# Altium schematic sheet 1_Power_Path.SchDoc: Power_Path
size A4; ApprovedBy: Alcatraz; CheckedBy: Alcatraz; Author: Alcatraz; CompanyName: DHNLAB; DrawnBy: Alcatraz; Engineer: Alcatraz; Organization: DHNLAB PVT LTD; Address1: DHANBAD; Address2: JHARKHAND; Address3: INDIA; Address4: ASIA; DocumentNumber: 1; Revision: 1.0; SheetNumber: 1; SheetTotal: 7; ProjectTitle: USB-UART-ISO-CP2102
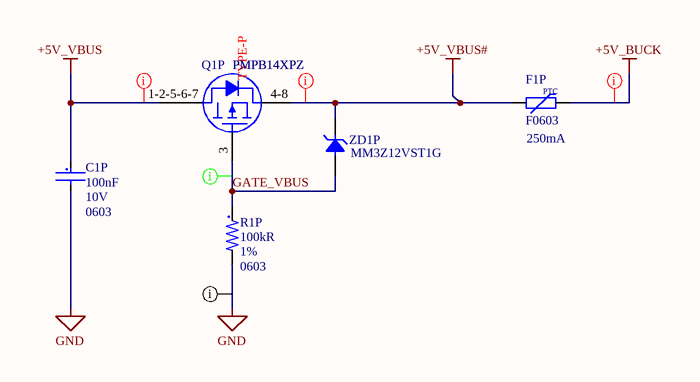
[diagram p0: 1_Power_Path.SchDoc]

## Parts
C1P  value 100nF  Voltage: 10V  Case/Package: 0603  [C0603-IPC_C_No_Silk]  (hidden comment: C0603C104K8RACTU)
F1P  F0603  value 250mA  [R0603-MFG]
Q1P  PMPB14XPZ  [DFN2020MD-MFG]
R1P  value 100kR  Tolerance: 1%  Case/Package: 0603  [R0603-MFG]  (hidden comment: AC0603FR-07100KL)
ZD1P  MM3Z12VST1G  [SOD-323]

## Nets
+5V_BUCK: F1P.2
+5V_VBUS: C1P.1 Q1P.1-2-5-6-7(D)
+5V_VBUS#: F1P.1 Q1P.4-8(S) ZD1P.1(C)
GND: C1P.2 R1P.2
GATE_VBUS: Q1P.3(G) R1P.1 ZD1P.2(A)

## Layout directives
net class Power; net class PowerRails_LowVoltage_DC: +5V_BUCK, +5V_VBUS, +5V_VBUS#
net class GND; net class PowerRails_GND: GND
net class Digital_Signal_Low_Speed; net class Signal: GATE_VBUS

## Notes on the sheet
- Title:
- Author:
- Approved:
- Size:
- Date:
- Git Hash:
- A4
- Prj:
- SW Version:
- Variant:
- Edited:
- PUBLIC
- File:
- (in symbol FUSE_PPTC_0603) PTC
- (in symbol PMPB14XPZ) TYPE-P

## Library data of the parts
C1P = 100nF_10V: Multilayer Ceramic Capacitor, 0.1 uF, 10 V, ± 10%, X7R, 0603 [1608 Metric]; Manufacturer: KEMET; Material: 4241ConductorMaterial; Dissipation Factor: 5%; Temperature Coefficient: 30ppm/°C; Manufacturer Part Number: C0603C104K8RACTU; Supplier 1: Mouser; Category: Ceramic Capacitors; Stock 1: 246409; Pricing 1: 1=0.11, 10=0.075, 50=0.075, 100=0.036, 1000=0.021, 10000=0.017 (USD); Supplier Part Number 1: 80-C0603C104K8R; RoHS: Yes; Mounting Technology: Surface Mount,PCB; Pins: 2; Case Code (Imperial): 0603; Case Code (Metric): 1608; Dielectric Material: Ceramic; Min Operating Temperature: -55°C; Max Operating Temperature: 125°C; Tolerance: 10%; Voltage Rating: 10V; Packaging: Tape and Reel; Dielectric: X7R; Series: C; Package Quantity: 1; Termination: SMD/SMT; Construction: Flat; Length: 1.6mm; Width: 0.031inch; Height: 0.8mm; Thickness: 0.034inch; Lead Pitch: 0.7mm; Depth: 0.8mm; Radiation Hardening: No; Reach SVHC Compliant: No; RoHS Compliant: Yes; Lead Free: 5697LeadFree; ComponentLink1URL: https://datasheet.ciiva.com/6093/1776114-6093269.pdf?src-supplier=Farnell; ComponentLink1Description: https://datasheet.ciiva.com/6093/1776114-6093269.pdf?src-supplier=Farnell; ComponentLink2URL: https://datasheet.ciiva.com/7823/kem-c1002-x7r-smd-7823989.pdf?src-supplier=Element14; ComponentLink2Description: https://datasheet.ciiva.com/7823/kem-c1002-x7r-smd-7823989.pdf?src-supplier=Element14; ComponentLink3URL: https://datasheet.ciiva.com/22693/1851736-22693967.pdf?src-supplier=Element14; ComponentLink3Description: https://datasheet.ciiva.com/22693/1851736-22693967.pdf?src-supplier=Element14; ComponentLink4URL: https://datasheet.ciiva.com/14589/70095383-14589402.pdf?src-supplier=Allied+Electronics; ComponentLink4Description: https://datasheet.ciiva.com/14589/70095383-14589402.pdf?src-supplier=Allied+Electronics; ComponentLink5URL: https://datasheet.ciiva.com/14593/70095383-14593978.pdf?src-supplier=Allied+Electronics; ComponentLink5Description: https://datasheet.ciiva.com/14593/70095383-14593978.pdf?src-supplier=Allied+Electronics; ComponentLink6URL: https://datasheet.ciiva.com/5419/kem-c1002-x7r-smd-357932-5419657.pdf?src-supplier=Mouser; ComponentLink6Description: https://datasheet.ciiva.com/5419/kem-c1002-x7r-smd-357932-5419657.pdf?src-supplier=Mouser; ComponentLink7URL: https://datasheet.ciiva.com/18192/getdatasheetpartid-91529-18192711.pdf?src-supplier=Verical; ComponentLink7Description: https://datasheet.ciiva.com/18192/getdatasheetpartid-91529-18192711.pdf?src-supplier=Verical; Voltage Rating (DC): 10V
F1P = FUSE_PPTC_0603: Fuse PPTC SMD 0603; Manufacturer: *; Manufacturer Part Number: *
Q1P = PMPB14XPZ: Manufacturer: Nexperia; Supplier 1: Element14; Supplier Part Number 1: 4177131; Manufacturer Part Number: PMPB14XPZ; RoHS: No; Stock 1: 3000
R1P = 100K: SMD Chip Resistor, 100 kOhm, ± 1%, 100 mW, 0603 [1608 Metric], Thick Film, General Purpose; Manufacturer: Yageo; Power Rating: 100mW; Temperature Coefficient: 100ppm/°C; Voltage Rating: 50V; Working Voltage: 75V; Supplier 1: Future Electronics; Manufacturer Part Number: AC0603FR-07100KL; RoHS: Yes; Category: Chip SMD Resistors; Stock 1: 3790000; Pricing 1: 5000=0.0034, 25000=0.0018, 75000=0.0032, 125000=0.0017, 250000=0.0031, 750000=0.003, 2500000=0.0027 (USD); Case Code (Imperial): 0603; Case Code (Metric): 1608; Min Operating Temperature: -55°C; Max Operating Temperature: 155°C; Packaging: Tape and Reel; Series: AC; Termination: SMD/SMT; Construction: Rectangular; Length: 1.6mm; Depth: 0.8mm; RoHS Compliant: Yes; Military Standard: Not; Lead Free: 5697LeadFree; Supplier Part Number 1: 6029288; Max Power Dissipation: 100mW; Features: Moisture Resistant,Automotive AEC-Q200; Number of Terminations: 2; Technology: THICK FILM; Moisture Sensitivity Level: 1; Ratings: AEC-Q200; ComponentLink1URL: https://datasheet.ciiva.com/26862/getdatasheetpartid-715379-26862460.pdf?src-supplier=Verical; ComponentLink1Description: https://datasheet.ciiva.com/26862/getdatasheetpartid-715379-26862460.pdf?src-supplier=Verical; ComponentLink2URL: https://datasheet.ciiva.com/5562/pyu-ac-51-rohs-l-2-5562536.pdf?src-supplier=Mouser; ComponentLink2Description: https://datasheet.ciiva.com/5562/pyu-ac-51-rohs-l-2-5562536.pdf?src-supplier=Mouser
ZD1P = MM3Z12VST1G: MM3Z12VST1G Zener Diode, 12V 2% 200 mW SMT 2-Pin SOD-323 | ON Semiconductor MM3Z12VST1G; Max Power Dissipation: 300mW; Impedance: 25R; Power Dissipation: 200mW; Max Reverse Leakage Current: 100nA; Test Current: 5mA; Forward Voltage: 900mV; Zener Current: 10mA; Supplier 1: Onlinecomponents.com; Supplier Part Number 1: MM3Z12VST1G; Manufacturer: ON Semiconductor; Manufacturer Part Number: MM3Z12VST1G; RoHS: Yes; Category: Zener Diodes; Stock 1: 60000; Pricing 1: 3000=0.0152, 6000=0.0145, 9000=0.0143, 27000=0.0137, 51000=0.0133, 102000=0.0128, 252000=0.0125, 501000=0.0123 (USD); Case/Package: SOD-323-2; Min Operating Temperature: -65°C; Max Operating Temperature: 150°C; Packaging: Tape and Reel; Package Quantity: 3000; Zener Voltage: 12V; Voltage Tolerance: 2%; Tolerance: 2%; Series: -; RoHS Compliant: Yes; ComponentLink1URL: https://datasheet.ciiva.com/30478/0900766b8127c8bd-30478408.pdf?src-supplier=Rs; ComponentLink1Description: https://datasheet.ciiva.com/30478/0900766b8127c8bd-30478408.pdf?src-supplier=Rs; ComponentLink2URL: https://datasheet.ciiva.com/16292/mm3z12vst1g-16292931.pdf?src-supplier=Future+Electronics; ComponentLink2Description: https://datasheet.ciiva.com/16292/mm3z12vst1g-16292931.pdf?src-supplier=Future+Electronics; ComponentLink3URL: https://datasheet.ciiva.com/22626/1878251-22626885.pdf?src-supplier=Element14; ComponentLink3Description: https://datasheet.ciiva.com/22626/1878251-22626885.pdf?src-supplier=Element14; Pins: 2; Material: Plastic; Working Voltage: 12V; Max Reverse Current: 100nA; Voltage Rating (DC): 12V; Power Rating: 200mW; Length: 1.8mm; Width: 1.35mm; Height: 1mm; Radiation Hardening: No; Lead Free: Lead Free; Reach SVHC Compliant: No; ComponentLink4URL: https://datasheet.ciiva.com/894/mm3z2v4st1-d-894650.pdf?src-supplier=Digikey; ComponentLink4Description: https://datasheet.ciiva.com/894/mm3z2v4st1-d-894650.pdf?src-supplier=Digikey; ComponentLink5URL: https://datasheet.ciiva.com/894/mm3z2v4st1-d-894651.pdf?src-supplier=Digikey; ComponentLink5Description: https://datasheet.ciiva.com/894/mm3z2v4st1-d-894651.pdf?src-supplier=Digikey; ComponentLink6URL: https://datasheet.ciiva.com/894/mm3z2v4st1-d-894649.pdf?src-supplier=Digikey; ComponentLink6Description: https://datasheet.ciiva.com/894/mm3z2v4st1-d-894649.pdf?src-supplier=Digikey